# EasyEDA Pro project 2024-4T-MNT-1.eprj

# Schematic SCH
Create Date: 2024-03-03; Page Name: S1; Project Name: 2024-4T-MNT-1; Schematic Name: SCH; Update Date: 2024-03-03
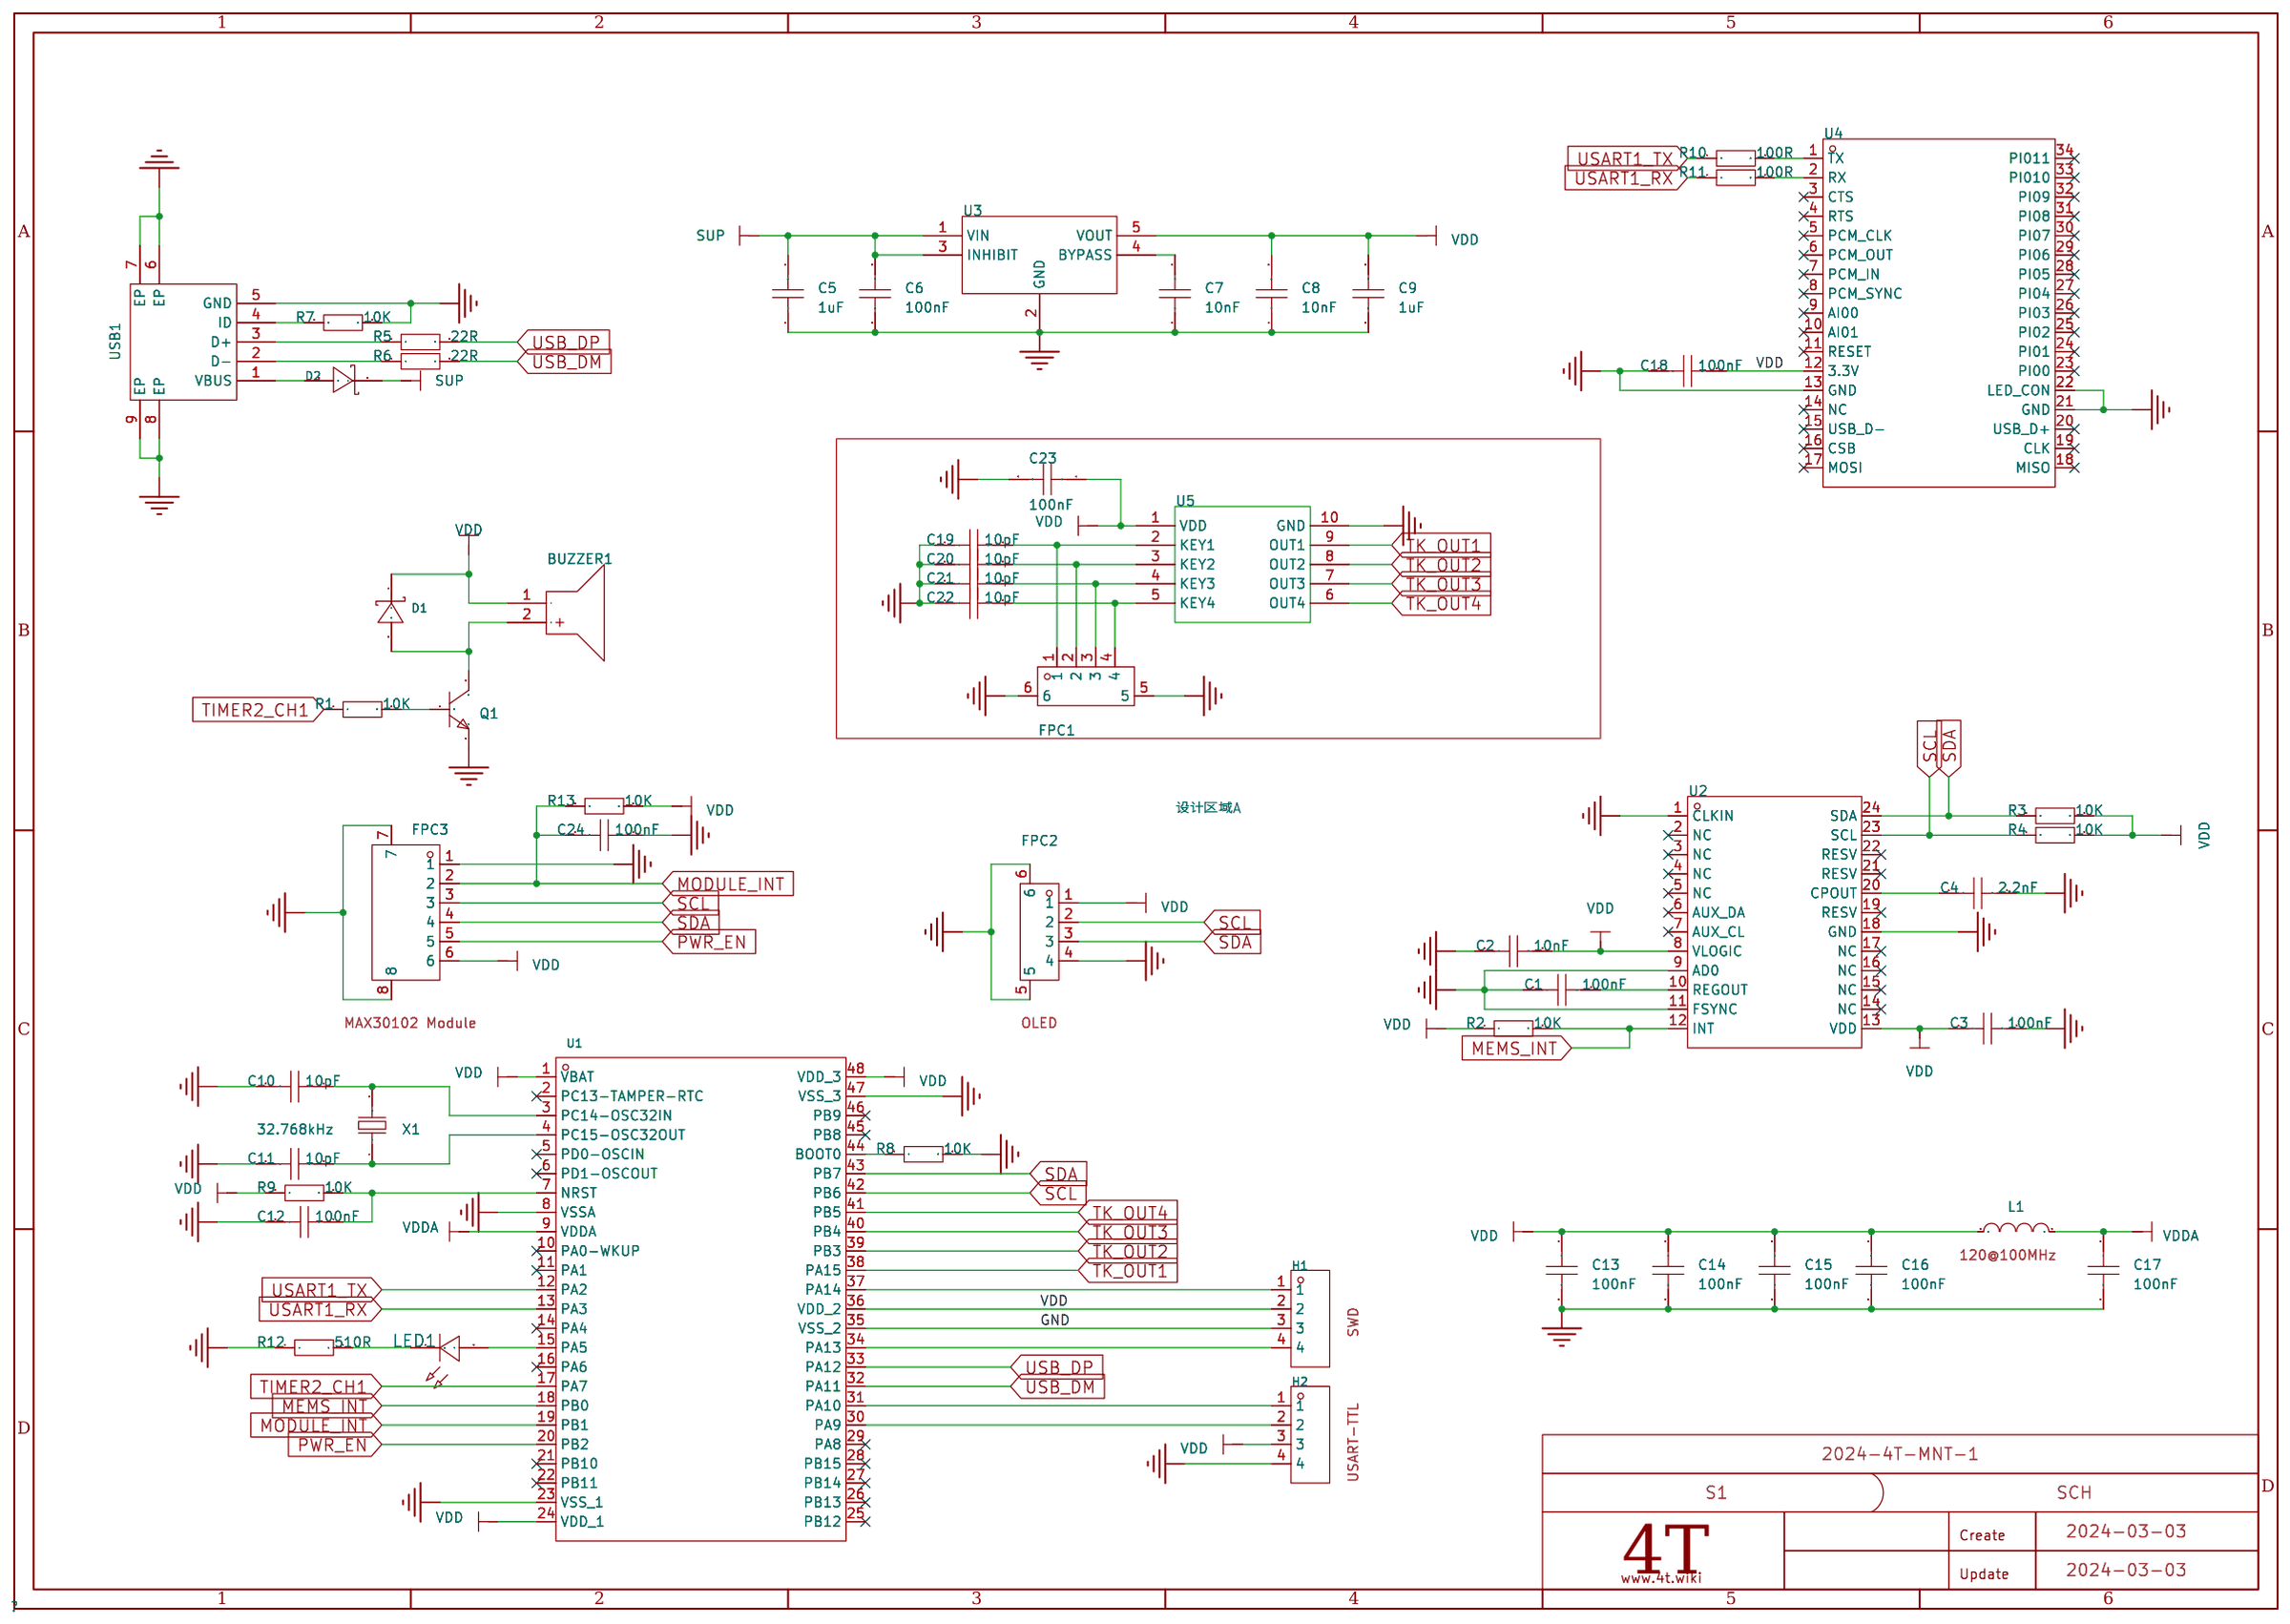
[diagram p0: schematic sheet]

## Parts
BUZZER1  buzzer  [BUZ-TH_BD12.0-P6.00-D0.9-RD]
C1  100nF  [C0805]
C2  10nF  [C0805]
C3  100nF  [C0805]
C4  2.2nF  [C0805]
C5  1uF  [C0805]
C6  100nF  [C0805]
C7  10nF  [C0805]
C8  10nF  [C0805]
C9  1uF  [C0805]
C10  10pF  [C0805]
C11  10pF  [C0805]
C12  100nF  [C0805]
C13  100nF  [C0805]
C14  100nF  [C0805]
C15  100nF  [C0805]
C16  100nF  [C0805]
C17  100nF  [C0805]
C18  100nF  [C0805]
C19  10pF  [C0805]
C20  10pF  [C0805]
C21  10pF  [C0805]
C22  10pF  [C0805]
C23  100nF  [C0805]
C24  100nF  [C0805]
D1  SS14  [SMA_L4.2-W2.6-LS5.3-RD]
D2  SS14  [SMA_L4.2-W2.6-LS5.3-RD]
FPC1  FPC-4PIN-1.0MM-上接  [FPC-SMD_4P-P1.00_AFA07-S04ECC-00]
FPC2  FPC-4PIN-1.0MM-上接  [FPC-SMD_4P-P1.00_AFA07-S04ECC-00]
FPC3  FPC6-0.5mm  [FPC-SMD_6P-L9.3-W4.1-P0.50]
H1  -  [HDR-TH_4P-P2.54-V-F]
H2  -  [HDR-TH_4P-P2.54-V-F]
L1  ACMS201209A6012A  [L0805]
LED1  -  [LED_0805]
Q1  S8050  [SOT-23-3_L2.9-W1.3-P1.90-LS2.4-BR]
R1  10K  [R0805]
R2  10K  [R0805]
R3  10K  [R0805]
R4  10K  [R0805]
R5  22R  [R0805]
R6  22R  [R0805]
R7  10K  [R0805]
R8  10K  [R0805]
R9  10K  [R0805]
R10  100R  [R0805]
R11  100R  [R0805]
R12  510R  [R0805]
R13  10K  [R0805]
U1  GD32F303CBT6  [LQFP-48_L7.0-W7.0-P0.50-LS9.0-BL]
U2  MPU6050  [QFN-24_L4.0-W4.0-P0.50-BL]
U3  LD3985M33R  [SOT-23-5_L3.0-W1.7-P0.95-LS2.8-BR]
U4  HC-05  [BULETM-SMD_HC-05]
U5  -  [SOT-CT4]
USB1  MicroUSB-5PIN  [USB-SMD_5P_MICROUSB-5PIN]
X1  32.768kHz  [FC-135R_L3.2-W1.5]

## Library data of the parts
BUZZER1 = buzzer: Supplier Part: C9900014030; JLCPCB Part Class: 扩展库; Supplier: LCSC
C1-C24 = CAP_0805: Supplier Footprint: 0805
D1 D2 = SS14_C2480: 二极管配置:独立式;直流反向耐压(Vr):40V;平均整流电流(Io):1A;正向压降(Vf):550mV@1A;; LCSC Part Name: 电压:40V 电流:1A 框架工艺; Supplier Part: C2480; Manufacturer: MDD; Supplier Footprint: SMA(DO-214AC); JLCPCB Part Class: 基础库; Datasheet: https://atta.szlcsc.com/upload/public/pdf/source/20230712/2DB6064CFBB99DE6DB116BEE8208BE66.pdf; Supplier: LCSC; Diode Configuration: 独立式; Reverse Voltage (Vr): 40V; Average Rectified Current (Io): 1A; Forward Voltage (Vf@If): 550mV@1A; Reverse Leakage Current (Ir): 500uA@40V
FPC1 = FPC-4PIN-1.0MM-上接: Supplier Part: C9900018775; Supplier Footprint: 4Pin_FPC_1mm; JLCPCB Part Class: 扩展库; Datasheet: https://atta.szlcsc.comnull; Supplier: LCSC
FPC2 = FPC-4PIN-1.0MM-上接: OLED; Supplier Part: C9900018775; Supplier Footprint: 4Pin_FPC_1mm; JLCPCB Part Class: 扩展库; Datasheet: https://atta.szlcsc.comnull; Supplier: LCSC
FPC3 = FPC6-0.5mm: MAX30102 Module; Supplier Part: C9900007660; Supplier Footprint: FPC-6P,0.5mm,上接; JLCPCB Part Class: 扩展库; Datasheet: https://atta.szlcsc.comnull; Supplier: LCSC
H1 = HDR-F_2.54_1x4P: SWD; Supplier Part: C2718488; Supplier Footprint: 插件
H2 = HDR-F_2.54_1x4P: USART-TTL; Supplier Part: C2718488; Supplier Footprint: 插件
L1 = ACMS201209A6012A: 120@100MHz; LCSC Part Name: 单路 0805磁珠 阻抗600Ω@100MHz; Supplier Part: C963878; Manufacturer: HYHONGYEX(宏业); Supplier Footprint: 0805; JLCPCB Part Class: 扩展库; Datasheet: https://atta.szlcsc.com/upload/public/pdf/source/20201201/C963878_9A58496702C302FABFA03D4B99520494.pdf; Supplier: LCSC; Impedance @ Frequency: 600Ω@100MHz; Tolerance: ±25%; DC Resistance: 100mΩ; Current Rating: 2A; Circuits: 1
LED1 = LED_0805-R: Supplier Footprint: 0805
Q1 = S8050: NPN 25V 500mA 120-400 SOT-23; LCSC Part Name: NPN 25V 500mA 120-400 SOT-23; Supplier Part: C2931719; Manufacturer: Doeshare(德芯); Supplier Footprint: SOT-23; JLCPCB Part Class: 扩展库; Datasheet: https://atta.szlcsc.com/upload/public/pdf/source/20220117/E6D3315E0D6ADDB25840BFFAC039C5C0.pdf; Supplier: LCSC
R1-R13 = Res_0805: Supplier Footprint: 0805
U1 = GD32F303CBT6: LCSC Part Name: 被合并商品; Supplier Part: C3013781; Supplier Footprint: LQFP-48(7x7); JLCPCB Part Class: 扩展库; Supplier: LCSC
U2 = MPU6050: Supplier Part: C9900042518; Supplier Footprint: QFN-24_L4.0-W4.0-P0.50-BL-EP2.7; Supplier: LCSC
U3 = LD3985M33R: 输出类型:固定;输出极性:正;最大输入电压:6V;输出电压:3.3V;输出电流:150mA;电源纹波抑制比(PSRR):60dB;; LCSC Part Name: 输入6V 输出3.3V 150mA; Supplier Part: C46243; Manufacturer: ST(意法半导体); Supplier Footprint: SOT-23-5; JLCPCB Part Class: 扩展库; Datasheet: https://atta.szlcsc.com/upload/public/pdf/source/20150407/1457707276603.pdf; Supplier: LCSC; Output Type: 固定; Output Polarity: 正; Number of Outputs: 1; Maximum Input Voltage: 6V; Output Voltage: 3.3V; Dropout Voltage: 100mV@(150mA); Quiescent Current (Ground Current): 150uA; Output Current: 150mA; Power Supply Rejection Ratio (PSRR): 60dB; Operating Temperature: -40℃~+125℃
U4 = HC-05: Supplier Part: C9900001063; Supplier Footprint: SMD-34_13.0X27.0X1.50P; JLCPCB Part Class: 扩展库; Datasheet: 2021-10-26/262798S/0744a6e575994a8186035cee355055ea/HC-05.pdf; Supplier: LCSC
U5 = CT4
USB1 = MicroUSB-5PIN: Supplier Part: C9900001196; Supplier Footprint: MicroUSB-5PIN,; JLCPCB Part Class: 扩展库; Supplier: LCSC
X1 = Q13FC1350000400: 频率:32.768kHz;频率公差:±20ppm;负载电容:12.5pF;; LCSC Part Name: 32.768kHz ±20ppm 12.5pF; Supplier Part: C32346; Manufacturer: EPSON(爱普生); Supplier Footprint: SMD3215-2P; JLCPCB Part Class: 基础库; Datasheet: https://atta.szlcsc.com/upload/public/pdf/source/20190108/C32346_746D6B07EAF90824457A96480007685F.pdf; Supplier: LCSC; Crystal Type: 贴片无源晶振; Frequency Tolerance: ±20ppm; Load Capacitance: 12.5pF; Equivalent Series Resistance (ESR): 70kΩ; Operating Temperature: -40℃~+85℃

## Nets
GND: C1.1 C2.1 C3.2 C4.2 C5.1 C6.1 C7.1 C8.1 C9.1 C10.2 C11.2 C12.2 C13.2 C14.2 C15.2 C16.2 C17.2 C18.1 C19.1 C20.1 C21.1 C22.1 C23.2 C24.1 FPC1.5 FPC1.6 FPC2.4 FPC2.5 FPC2.6 FPC3.1 FPC3.7 FPC3.8 H1.3 H2.4 Q1.2(E) R7.2 R8.2 R12.1 U1.8(VSSA) U1.23(VSS_1) U1.35(VSS_2) U1.47(VSS_3) U2.1(CLKIN) U2.9(AD0) U2.11(FSYNC) U2.18(GND) U3.2(GND) U4.13(GND) U4.21(GND) U4.22(LED_CON) U5.10(GND) USB1.5(GND) USB1.6(EP) USB1.7(EP) USB1.8(EP) USB1.9(EP)
VDD: BUZZER1.1(-) C2.2 C3.1 C8.2 C9.2 C13.1 C14.1 C15.1 C16.1 C18.2 C23.1 D1.1(K) FPC2.1 FPC3.6 H1.2 H2.3 L1.1 R2.1 R3.2 R4.2 R9.1 R13.2 U1.1(VBAT) U1.24(VDD_1) U1.36(VDD_2) U1.48(VDD_3) U2.8(VLOGIC) U2.13(VDD) U3.5(VOUT) U4.12(3.3V) U5.1(VDD)
VDDA: C17.1 L1.2 U1.9(VDDA)
MEMS_INT: R2.2 U1.18(PB0) U2.12(INT)
MODULE_INT: C24.2 FPC3.2 R13.1 U1.19(PB1)
PWR_EN: FPC3.5 U1.20(PB2)
SCL: FPC2.2 FPC3.3 R4.1 U1.42(PB6) U2.23(SCL)
SDA: FPC2.3 FPC3.4 R3.1 U1.43(PB7) U2.24(SDA)
SUP: C5.2 C6.2 D2.1(K) U3.1(VIN) U3.3(INHIBIT)
TIMER2_CH1: R1.1 U1.17(PA7)
TK_OUT1: U1.38(PA15) U5.9(OUT1)
TK_OUT2: U1.39(PB3) U5.8(OUT2)
TK_OUT3: U1.40(PB4) U5.7(OUT3)
TK_OUT4: U1.41(PB5) U5.6(OUT4)
USART1_RX: R11.1 U1.13(PA3)
USART1_TX: R10.1 U1.12(PA2)
USB_DM: R6.2 U1.32(PA11)
USB_DP: R5.2 U1.33(PA12)
$1N797: BUZZER1.2(+) D1.2(A) Q1.3(C)
$1N941: Q1.1(B) R1.2
$1N1221: C1.2 U2.10(REGOUT)
$1N1494: C4.1 U2.20(CPOUT)
$1N2047: R5.1 USB1.3(D+)
$1N2049: R6.1 USB1.2(D-)
$1N2097: R7.1 USB1.4(ID)
$1N2146: D2.2(A) USB1.1(VBUS)
$1N2344: C7.2 U3.4(BYPASS)
$1N2714: C10.1 U1.3(PC14-OSC32IN) X1.2
$1N2721: C11.1 U1.4(PC15-OSC32OUT) X1.1
$1N2943: R8.1 U1.44(BOOT0)
$1N3028: C12.1 R9.2 U1.7(NRST)
$1N3436: H1.1 U1.37(PA14)
$1N3445: H1.4 U1.34(PA13)
$1N3538: H2.1 U1.31(PA10)
$1N3541: H2.2 U1.30(PA9)
$1N4058: R10.2 U4.1(TX)
$1N4090: R11.2 U4.2(RX)
$1N5224: LED1.1(C) R12.2
$1N5231: LED1.2(A) U1.15(PA5)
$1N8240: C19.2 FPC1.1 U5.2(KEY1)
$1N8253: C20.2 FPC1.2 U5.3(KEY2)
$1N8266: C21.2 FPC1.3 U5.4(KEY3)
$1N8289: C22.2 FPC1.4 U5.5(KEY4)

Not connected (* = marked no-connect by the designer): U1 2(PC13-TAMPER-RTC)* 5(PD0-OSCIN)* 6(PD1-OSCOUT)* 10(PA0-WKUP)* 11(PA1)* 14(PA4)* 16(PA6)* 21(PB10)* 22(PB11)* 25(PB12)* 26(PB13)* 27(PB14)* 28(PB15)* 29(PA8)* 45(PB8)* 46(PB9)*; U2 2(NC)* 3(NC)* 4(NC)* 5(NC)* 6(AUX_DA)* 7(AUX_CL)* 14(NC)* 15(NC)* 16(NC)* 17(NC)* 19(RESV)* 21(RESV)* 22(RESV)*; U4 3(CTS)* 4(RTS)* 5(PCM_CLK)* 6(PCM_OUT)* 7(PCM_IN)* 8(PCM_SYNC)* 9(AI00)* 10(AI01)* 11(RESET)* 14(NC)* 15(USB_D-)* 16(CSB)* 17(MOSI)* 18(MISO)* 19(CLK)* 20(USB_D+)* 23(PI00)* 24(PI01)* 25(PI02)* 26(PI03)* 27(PI04)* 28(PI05)* 29(PI06)* 30(PI07)* 31(PI08)* 32(PI09)* 33(PI010)* 34(PI011)*

## Notes on the sheet
- 设计区域A

# Board PCB
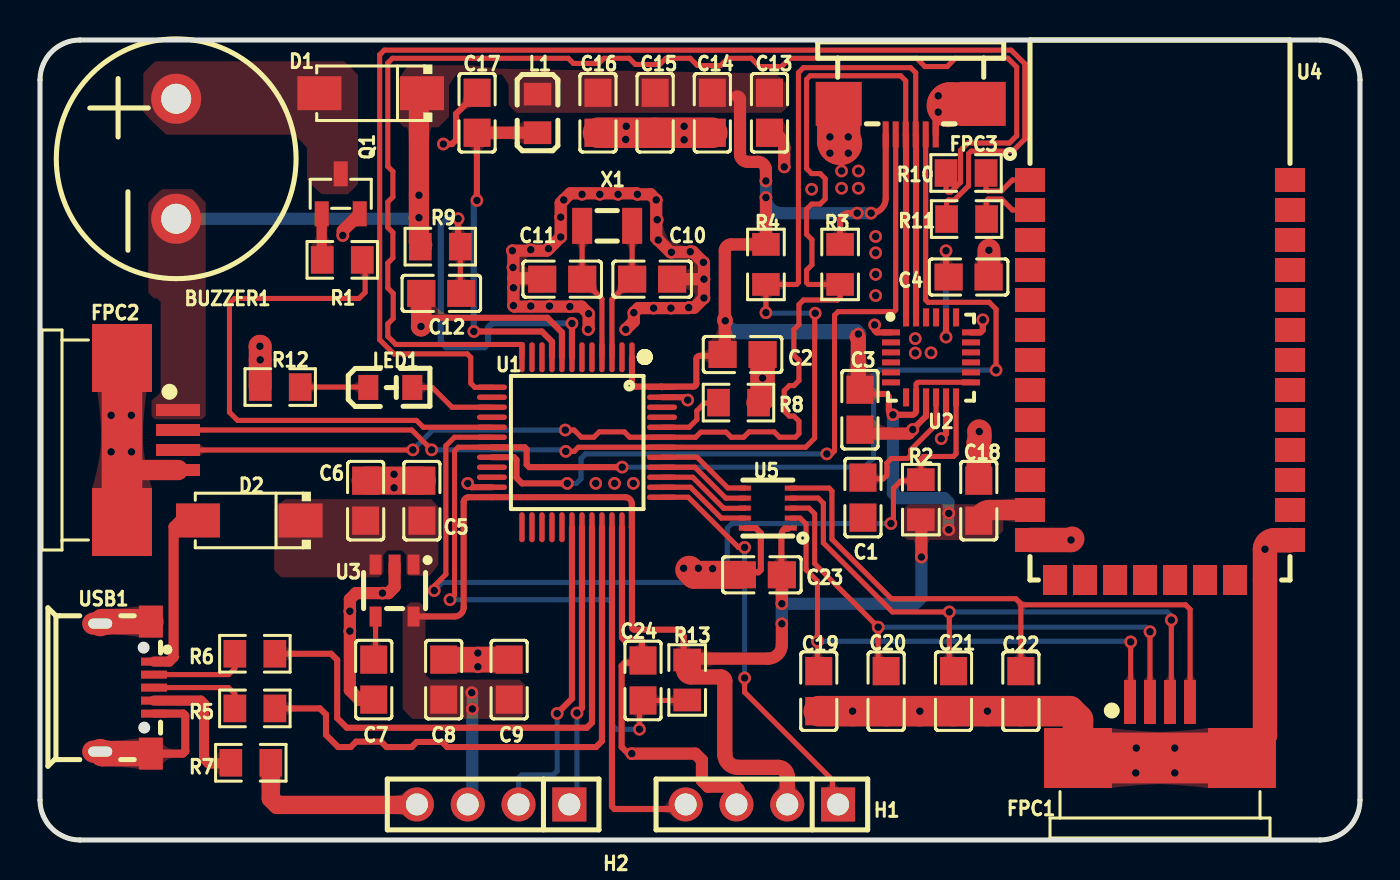
[diagram p1: board, top side]
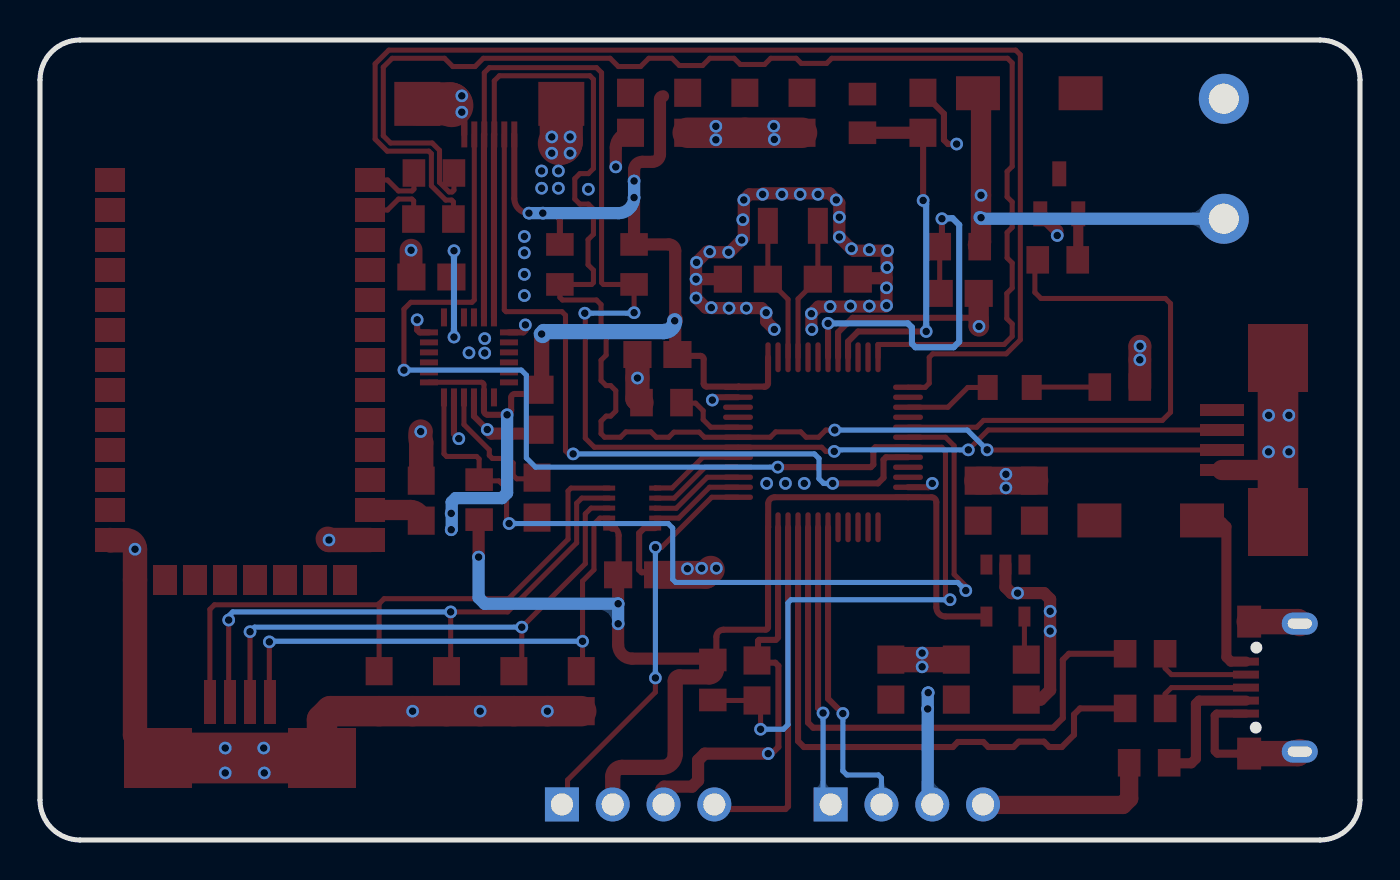
[diagram p2: board, bottom side, seen from below]

Outline 66 x 40 mm; copper layers: Top Layer, Bottom Layer. Coordinates in mm from the lower left corner of the outline.
Outline path: 0,38 0,2 arc(0.59,0.59) 2,0 64,0 arc(65.41,0.59) 66,2 66,38 arc(65.41,39.41) 64,40 2,40 arc(0.59,39.41) 0,38
Stack: Top Layer 0.035mm / Dielectric1 1.51mm FR4 er 4.5 / Bottom Layer 0.035mm

## Design rules (mm)
net $1N2714: DP4
net $1N2721: DP4
net USART1_TX: DP6
net USART1_RX: DP6
net USB_DM: DP3
net USB_DP: DP3
net SCL: DP1
net SDA: DP1
net $1N2047: DP2
net $1N2049: DP2
net $1N4058: DP5
net $1N4090: DP5
template: 自定义配置
spacing copperThickness1oz (default): track to track 0.178, other pairs 0.152 to 0.381
spacing copperThickness2oz: track to track 0.203, other pairs 0.152 to 0.3
track width copperThickness1oz (default): min 0.203, default 0.305, max 2.54
track width copperThickness2oz: min 0.203, default 0.254, max 2.54
track width trackWidth1: min 0.127, default 0.254, max 2.54
track width PWR: min 0.254, default 0.61, max 2.54
differential pair differentialPair (default): width min 0.127, default 0.254, max 2.54; gap min 0.152, default 0.152
via viaSize (default): diameter min 0.635, default 0.635, max 10; hole min 0.381, default 0.381, max 6.299
net VDD uses PWR
net GND uses PWR
net VDDA uses PWR
net SUP uses PWR

## Placement (name value [footprint] x y rotation side)
BUZZER1  buzzer  [BUZ-TH_BD12.0-P6.00-D0.9-RD]  6.81 34.06 90 top
C1  100nF  [C0805]  41.15 17.12 90 top
C2  10nF  [C0805]  35.13 24.27 180 top
C3  100nF  [C0805]  41 21.51 270 top
C4  2.2nF  [C0805]  46.43 28.15 0 top
C5  1uF  [C0805]  19.09 16.97 270 top
C6  100nF  [C0805]  16.28 16.97 270 top
C7  10nF  [C0805]  16.69 8.02 90 top
C8  10nF  [C0805]  20.19 8.02 270 top
C9  1uF  [C0805]  23.46 8.02 270 top
C10  10pF  [C0805]  30.61 28.04 0 top
C11  10pF  [C0805]  26.11 28.04 180 top
C12  100nF  [C0805]  20.07 27.33 180 top
C13  100nF  [C0805]  36.47 36.36 270 top
C14  100nF  [C0805]  33.62 36.36 270 top
C15  100nF  [C0805]  30.76 36.36 270 top
C16  100nF  [C0805]  27.9 36.36 270 top
C17  100nF  [C0805]  21.85 36.36 90 top
C18  100nF  [C0805]  46.94 16.97 270 top
C19  10pF  [C0805]  38.94 7.44 90 top
C20  10pF  [C0805]  42.31 7.44 90 top
C21  10pF  [C0805]  45.68 7.44 90 top
C22  10pF  [C0805]  49.04 7.44 90 top
C23  100nF  [C0805]  36.09 13.26 180 top
C24  100nF  [C0805]  30.15 7.98 270 top
D1  SS14  [SMA_L4.2-W2.6-LS5.3-RD]  16.54 37.34 180 top
D2  SS14  [SMA_L4.2-W2.6-LS5.3-RD]  10.47 15.98 180 top
FPC1  FPC-4PIN-1.0MM-上接  [FPC-SMD_4P-P1.00_AFA07-S04ECC-00]  56 5.5 0 top
FPC2  FPC-4PIN-1.0MM-上接  [FPC-SMD_4P-P1.00_AFA07-S04ECC-00]  5.5 20 270 top
FPC3  FPC6-0.5mm  [FPC-SMD_6P-L9.3-W4.1-P0.50]  43.54 36.04 180 top
H1  -  [HDR-TH_4P-P2.54-V-F]  36.09 1.78 180 top
H2  -  [HDR-TH_4P-P2.54-V-F]  22.66 1.78 180 top
L1  ACMS201209A6012A  [L0805]  24.88 36.33 270 top
LED1  -  [LED_0805]  17.56 22.62 0 top
Q1  S8050  [SOT-23-3_L2.9-W1.3-P1.90-LS2.4-BR]  15.04 32.31 270 top
R1  10K  [R0805]  15.11 29.01 180 top
R2  10K  [R0805]  44.04 17.02 90 top
R3  10K  [R0805]  40 28.78 90 top
R4  10K  [R0805]  36.3 28.78 90 top
R5  22R  [R0805]  10.74 6.58 0 top
R6  22R  [R0805]  10.74 9.31 0 top
R7  10K  [R0805]  10.54 3.86 0 top
R8  10K  [R0805]  34.93 21.87 0 top
R9  10K  [R0805]  20.01 29.67 0 top
R10  100R  [R0805]  46.3 33.35 0 top
R11  100R  [R0805]  46.33 31.05 0 top
R12  510R  [R0805]  12.01 22.65 0 top
R13  10K  [R0805]  32.36 8 90 top
U1  GD32F303CBT6  [LQFP-48_L7.0-W7.0-P0.50-LS9.0-BL]  26.85 19.89 180 top
U2  MPU6050  [QFN-24_L4.0-W4.0-P0.50-BL]  44.55 24.13 270 top
U3  LD3985M33R  [SOT-23-5_L3.0-W1.7-P0.95-LS2.8-BR]  17.73 12.47 90 top
U4  HC-05  [BULETM-SMD_HC-05]  56 23 0 top
U5  -  [SOT-CT4]  37.54 15.6 90 top
USB1  MicroUSB-5PIN  [USB-SMD_5P_MICROUSB-5PIN]  4.36 7.62 270 top
X1  32.768kHz  [FC-135R_L3.2-W1.5]  28.36 30.71 0 top

## Footprints (pads in the part's own frame, mm; a bottom-side part is the same pattern mirrored in y, then rotated)
BULETM-SMD_HC-05
  rect 1.5x1.2 smd: 1(-6.5,10) 2(-6.5,8.5) 3(-6.5,7) 4(-6.5,5.5) 5(-6.5,4) 6(-6.5,2.5) 7(-6.5,1) 8(-6.5,-0.5) 9(-6.5,-2) 10(-6.5,-3.5) 11(-6.5,-5) 12(-6.5,-6.5) 13(-6.5,-8) 22(6.5,-8) 23(6.5,-6.5) 24(6.5,-5) 25(6.5,-3.5) 26(6.5,-2) 27(6.5,-0.5) 28(6.5,1) 29(6.5,2.5) 30(6.5,4) 31(6.5,5.5) 32(6.5,7) 33(6.5,8.5) 34(6.5,10)
  rect 1.2x1.5 smd: 14(-5.25,-10) 15(-3.75,-10) 16(-2.25,-10) 17(-0.75,-10) 18(0.75,-10) 19(2.25,-10) 20(3.75,-10) 21(5.25,-10)
BUZ-TH_BD12.0-P6.00-D0.9-RD
  round 2.5 hole 1.5: 1(-3,0) 2(3,0)
C0805
  rect 1.41x1.35 smd: 1(-1,0) 2(1,0)
FC-135R_L3.2-W1.5
  rect 1x1.8 smd: 1(-1.25,0) 2(1.25,0)
FPC-SMD_4P-P1.00_AFA07-S04ECC-00
  rect 0.6x2.2 smd: 1(-1.5,1.4) 2(-0.5,1.4) 3(0.5,1.4) 4(1.5,1.4)
  rect 3.4x3 smd: 5(4.1,-1.4) 6(-4.1,-1.4)
FPC-SMD_6P-L9.3-W4.1-P0.50
  rect 0.3x1.3 smd: 1(-1.25,0.764) 2(-0.75,0.764) 3(-0.25,0.764) 4(0.25,0.764) 5(0.75,0.764) 6(1.25,0.764)
  rect 2.3x2.2 smd: 7(-3.6,-0.764) 8(3.6,-0.764)
HDR-TH_4P-P2.54-V-F
  rect 1.7x1.7 hole 1.1: 1(-3.81,0)
  round 1.7 hole 1.1: 2(-1.27,0) 3(1.27,0) 4(3.81,0)
L0805
  rect 1.133x1.377 smd: 1(-0.966,0) 2(0.966,0)
LED_0805
  rect 1x1.25 smd: 1(-1.15,0.005) 2(1.05,0.005)
LQFP-48_L7.0-W7.0-P0.50-LS9.0-BL
  oval 0.27x1.5 smd: 1(-2.75,-4.25) 2(-2.25,-4.25) 3(-1.75,-4.25) 4(-1.25,-4.25) 5(-0.75,-4.25) 6(-0.25,-4.25) 7(0.25,-4.25) 8(0.75,-4.25) 9(1.25,-4.25) 10(1.75,-4.25) 11(2.25,-4.25) 12(2.75,-4.25) 25(2.75,4.25) 26(2.25,4.25) 27(1.75,4.25) 28(1.25,4.25) 29(0.75,4.25) 30(0.25,4.25) 31(-0.25,4.25) 32(-0.75,4.25) 33(-1.25,4.25) 34(-1.75,4.25) 35(-2.25,4.25) 36(-2.75,4.25)
  oval 1.5x0.27 smd: 13(4.25,-2.75) 14(4.25,-2.25) 15(4.25,-1.75) 16(4.25,-1.25) 17(4.25,-0.75) 18(4.25,-0.25) 19(4.25,0.25) 20(4.25,0.75) 21(4.25,1.25) 22(4.25,1.75) 23(4.25,2.25) 24(4.25,2.75) 37(-4.25,2.75) 38(-4.25,2.25) 39(-4.25,1.75) 40(-4.25,1.25) 41(-4.25,0.75) 42(-4.25,0.25) 43(-4.25,-0.25) 44(-4.25,-0.75) 45(-4.25,-1.25) 46(-4.25,-1.75) 47(-4.25,-2.25) 48(-4.25,-2.75)
QFN-24_L4.0-W4.0-P0.50-BL
  rect 0.3x0.9 smd: 1(-1.25,-2) 2(-0.75,-2) 3(-0.25,-2) 4(0.25,-2) 5(0.75,-2) 6(1.25,-2) 13(1.25,2) 14(0.75,2) 15(0.25,2) 16(-0.25,2) 17(-0.75,2) 18(-1.25,2)
  rect 0.9x0.3 smd: 7(2,-1.25) 8(2,-0.75) 9(2,-0.25) 10(2,0.25) 11(2,0.75) 12(2,1.25) 19(-2,1.25) 20(-2,0.75) 21(-2,0.25) 22(-2,-0.25) 23(-2,-0.75) 24(-2,-1.25)
R0805
  rect 1.133x1.377 smd: 1(-1,0) 2(1,0)
SMA_L4.2-W2.6-LS5.3-RD
  rect 2.2x1.7 smd: 1(-2.566,0) 2(2.566,0)
SOT-23-3_L2.9-W1.3-P1.90-LS2.4-BR
  rect 1.25x0.7 smd: 1(1,-0.95) 2(1,0.95) 3(-1,0)
SOT-23-5_L3.0-W1.7-P0.95-LS2.8-BR
  rect 1x0.6 smd: 1(1.3,-0.95) 2(1.3,0) 3(1.3,0.95) 4(-1.3,0.95) 5(-1.3,-0.95)
SOT-CT4
  rect 0.25x0.6 smd: 1(0,0) 2(0.5,0) 3(1,0) 4(1.5,0) 5(2,0) 6(2,2.3) 7(1.5,2.3) 8(1,2.3) 9(0.5,2.3) 10(0,2.3)
USB-SMD_5P_MICROUSB-5PIN
  rect 0.4x1.3 smd: 1(-1.3,1.345) 2(-0.65,1.345) 3(0,1.345) 4(0.65,1.345) 5(1.3,1.345)
  rect 1.6x1.2 smd: 6(3.3,1.185) 7(-3.3,1.185)
  oval 1.1x1.8 hole 0.5x1.2: 8(3.2,-1.345) 9(-3.2,-1.345)

## Nets
As in the schematic.

Pads without a net: U1 2 5 6 10 11 14 16 21 22 25 26 27 28 29 45 46; U2 2 3 4 5 6 7 14 15 16 17 19 21 22; U4 3 4 5 6 7 8 9 10 11 14 15 16 17 18 19 20 23 24 25 26 27 28 29 30 31 32 33 34

## Via types
v1: diameter 0.635, hole 0.381, Top Layer to Bottom Layer, 141 vias

## Routing (per net, layer and track width the routed paths; a pad name or vN(x,y) marks a point on that pad's centre or on a via; arc(x,y) is an arc through that point)
GND: length 191
  Top Layer w0.305: 19.07,26.03 19.15,26.11 25.37,26.11 26.1,25.38 U1.8 ; U1.23 21.58,17.64 v1(21.39,17.83) ; U2.1 41.83,25.38 41.73,25.48 v1(41.73,25.76) ; C17.2 20.8,36.31 20.8,35 20.6,34.8 v1(20.17,34.8) ; FPC3.1 44.79,36.39 arc(44.78,36.41) 44.75,36.42 ; U1.47 32.24,22.14 v1(32.38,22) ; C23.2 35.22,13.39 35.92,13.39 36.04,13.51 36.04,15.34 35.79,15.6 U5.10 ; U2.9 44.3,21.19 v1(43.64,20.52) ; v1(45.06,20.07) 45.3,20.31 U2.11 ; v1(47.14,26.01) 47.14,25.5 47.02,25.38 U2.18 ; v1(29.59,4.32) 29.41,4.32 29.08,4.65 29.08,8.71 29.24,8.86 29.96,8.86 30.1,9 30.1,9.96 30.05,10.01 29.21,10.01 29.1,10.12 U1.35
  Top Layer w0.406: USB1.6 5.54,4.32 7.14,4.32 7.26,4.45 7.26,6.22 7.17,6.32 USB1.5
  Top Layer w0.61: v1(33.2,28.04) v1(33.2,27.1) 32.72,26.62 v1(32.44,26.62) 32.41,26.59 v1(31.55,26.59) v1(30.68,26.59) 29.92,26.59 v1(29.69,26.37) 29.69,25.93 v1(29.29,25.53) ; v1(33.2,28.04) 33.2,28.85 v1(33.17,28.88) 32.64,29.41 v1(32.51,29.41) 32.49,29.39 v1(31.57,29.39) 31.52,29.39 v1(30.91,30) 30.81,30.1 v1(30.81,32) 30.53,32.28 v1(29.87,32.28) 29.82,32.33 26.52,32.33 v1(26.19,32) 26.03,31.85 v1(26.03,31.14) v1(26.03,30.15) 25.45,29.57 v1(25.43,29.57) 25.32,29.46 v1(23.62,29.46) 23.67,29.41 23.67,28.09 ; v1(33.2,28.04) C10.2 ; C3.2 41.19,20.32 43.43,20.32 v1(43.64,20.52) ; v1(15.14,30.23) 15.14,30.46 Q1.2 ; 34.82,1.58 34.93,1.68 34.93,2.54 34.8,2.67 33.4,2.67 33.1,2.97 33.1,3.99 32.77,4.32 v1(29.59,4.32) ; U3.2 17.73,12.65 17.42,12.34 15.8,12.34 15.49,12.04 v1(15.49,11.44) v1(15.49,10.45) 15.49,7.49 15.97,7.02 C7.1 ; v1(37.21,33.66) 37.21,34.62 arc(37,35.15) C13.2 ; C11.2 25.06,28.09 23.67,28.09 ; 23.67,28.09 v1(23.67,27.61) v1(23.67,26.72) 23.72,26.67 v1(26.49,26.67) 27.08,26.67 v1(27.43,26.31) 27.43,25.55 v1(27.41,25.53)
  Top Layer w0.914: H2.4 18.82,1.75 11.86,1.75 11.54,2.07 R7.2
  Top Layer w1.016: 4.34,18.36 4.48,18.5 FPC2.4 ; v1(19.05,25.68) 19.07,25.7 C12.2
  Top Layer w1.143: R12.1 v1(11.01,24.01) 11.01,24.68 v1(11,24.69) ; v1(47.45,29.49) 47.45,28.17 C4.2
  Top Layer w1.219: R8.2 36.13,22.07 v1(36.13,23.1) C2.1 ; U4.13 v1(51.55,15) arc(51.59,15.02) 51.61,15.06 ; C18.1 46.94,19.86 arc(46.98,20.14) v1(46.96,20.42) ; FPC1.5 61.25,5.25 U4.21 v1(61.25,14.54) arc(61.38,14.86) 61.7,14.99 62.49,14.99 arc(62.5,14.99) U4.22
  Top Layer w1.27: USB1.9 3.11,10.92 USB1.7 ; USB1.6 3.11,4.32 USB1.8 ; C8.1 C9.1
  Top Layer w1.397: C6.1 C5.1 ; 32.46,13.51 32.72,13.26 C23.2
  Top Layer w1.524: FPC1.6 51.9,6.01 51.47,6.44 C22.1 v1(47.37,6.44) C21.1 v1(43.99,6.44) C20.1 v1(40.63,6.44) C19.1 ; C14.2 C15.2 C16.2
  Top Layer w2.032: FPC2.6 FPC2.5
  Top Layer w2.159: FPC3.7 45.49,36.81 arc(45.47,36.8) 45.45,36.79 arc(45.44,36.77) 45.44,36.75 45.41,36.72 ; FPC3.8 39.94,34.92 arc(39.94,34.88) 39.97,34.85 arc(40,34.83) 40.03,34.82
  Top Layer w2.54: FPC1.6 FPC1.5
  vias: v1(3.56,21.23) v1(3.56,19.41) v1(4.57,21.23) v1(4.57,19.41) v1(17.12,12.34) v1(17.7,18.29) v1(17.7,17.61) v1(21.9,9.35) v1(21.9,8.66) v1(23.65,28.63) v1(24.54,29.52) v1(24.54,26.7) v1(25.48,26.7) v1(27.1,32.28) v1(27.79,17.83) v1(27.99,32.28) v1(28.73,17.83) v1(28.91,32.28) v1(29.31,35.69) v1(29.29,35.03) v1(29.67,17.83) v1(30.86,31.01) v1(32.21,35.69) v1(32.21,35.01) v1(32.18,13.59) v1(32.92,13.59) v1(33.63,13.56) v1(38.58,32.54) v1(39.5,35.15) v1(39.5,34.34) v1(40.08,33.45) v1(40.08,32.59) v1(40.41,35.15) v1(40.41,34.34) v1(40.92,33.45) v1(40.92,32.59) v1(41.78,30.18) v1(41.78,29.36) v1(41.78,28.28) v1(41.78,27.22) v1(43.76,25.07) v1(43.76,24.35) v1(44.55,24.36) v1(44.91,37.21) v1(44.91,36.39) v1(54.81,4.6) v1(54.79,3.35) v1(56.74,4.6) v1(56.74,3.35)
VDD: length 151.8
  Top Layer w0.254: U2.8 43.8,22.77 arc(43.84,22.85) 43.92,22.89 46.55,22.89 arc(46.55,22.88) U2.13
  Top Layer w0.305: U2.8 43.8,21.45 arc(43.75,21.32) 43.61,21.26 v1(42.65,21.26) arc(42.49,21.34) 42.44,21.51 42.44,22.12 arc(42.39,22.25) 42.27,22.3 41.21,22.3 arc(41.06,22.36) C3.1 ; v1(40.86,31.34) 40.44,31.34 arc(40.13,31.22) 40,30.91 R3.2 ; 31.07,22.67 32.68,22.67 arc(32.78,22.71) 32.82,22.81 32.82,24.05 arc(32.86,24.16) 32.97,24.21 34.06,24.21 arc(34.11,24.23) C2.2 ; 31.07,22.67 31.08,22.66 arc(31.09,22.65) U1.48 ; 31.07,22.67 29.78,22.67 29.77,22.66 arc(29.65,22.71) 29.6,22.83 U1.1 ; 37.07,13.34 37.07,15.22 arc(37.11,15.41) 37.22,15.56 37.41,15.56 ; FPC3.6 42.29,32.08 arc(42.07,31.56) v1(41.55,31.34) ; 32.18,9 32.18,10.16 arc(32.08,10.41) 31.83,10.52 29.72,10.52 arc(29.63,10.55) 29.6,10.64 U1.36 arc(29.59,15.64) 29.59,15.65 29.59,16.82 arc(29.5,17.04) 29.27,17.14 U1.24 21.43,17.14 arc(21.26,17.07) 21.18,16.89 21.18,11.63 arc(21.05,11.31) 20.73,11.18 18.68,11.18 arc(18.68,11.17) U3.5
  Top Layer w0.61: v1(37.09,10.81) 37.09,9.76 arc(36.89,9.27) 36.4,9.07 32.25,9.07 arc(32.2,9.05) 32.18,9 ; 34.24,25.98 34.24,24.39 arc(34.21,24.31) C2.2 ; v1(44.07,14.15) 44.07,15.99 R2.1 ; C23.1 v1(37.09,11.81) ; v1(36.3,32.12) R4.2 34.55,29.78 arc(34.33,29.69) 34.24,29.46 34.24,26.04 ; v1(36.3,32.95) 36.3,33.5 arc(36.18,33.79) 35.89,33.91 35.38,33.91 arc(35.11,34.02) 35,34.29 35,37.03 arc(34.96,37.14) 34.85,37.19
  Top Layer w0.762: 32.18,9 32.18,8.51 arc(32.29,8.26) 32.54,8.15 34.04,8.15 arc(34.18,8.09) 34.24,7.95 34.24,4.29 arc(34.43,3.83) 34.9,3.63 36.91,3.63 arc(37.23,3.5) 37.36,3.18 37.36,1.58 ; 34.24,26.04 34.24,25.98 arc(34.25,25.97) v1(34.26,25.96) ; 40.87,25.17 40.87,25.15 40.92,25.1 40.92,22.33 40.87,22.29
  Top Layer w1.016: U4.12 47.47,16.5 arc(47.1,16.34) C18.2 ; D1.1 18.95,37.19 v1(18.95,32.24) v1(18.95,31.12) 18.95,29.91 19.1,29.75 arc(19.08,29.69) R9.1
  Bottom Layer w0.61: v1(42.65,21.26) 42.65,17.35 42.9,17.09 45.21,17.09 45.41,16.89 45.41,15.54 v1(45.44,15.51) ; v1(37.09,10.81) v1(37.09,11.81) 43.76,11.81 44.07,12.12 v1(44.07,14.15) ; v1(21.59,7.37) 21.62,7.34 v1(21.62,6.55) 21.62,2.01 H2.3 ; v1(41.55,31.34) v1(40.86,31.34) 37.07,31.34 arc(36.52,31.57) v1(36.3,32.12) v1(36.3,32.95) ; BUZZER1.1 18.95,31.06 arc(19,31.08) 19.02,31.14
  Bottom Layer w0.762: 40.81,25.43 40.81,25.42 34.8,25.42 34.8,25.43 arc(34.42,25.58) v1(34.26,25.96) ; 40.94,25.3 arc(40.91,25.24) 40.86,25.22
  vias: v1(40.92,25.3) v1(45.44,16.33)
VDDA: length 17.9
  Top Layer w0.305: C17.1 21.84,35.35 v1(21.84,31.98) ; U1.9 25.6,24.92 25.09,25.43 v1(21.69,25.43)
  Top Layer w0.61: C17.1 24.87,35.36
  Bottom Layer w0.305: v1(21.69,25.43) 21.69,31.83 v1(21.84,31.98)
MEMS_INT: length 44.8
  Top Layer w0.254: v1(42.54,15.82) 42.67,15.95 42.67,17.58 43.05,17.96 43.98,17.96 R2.2 44.04,19.05 44.17,19.18 45.67,19.18 45.8,19.31 U2.12 ; U1.18 20.72,20.14 20.29,19.71 20.29,13.28 19.71,12.7 v1(19.71,12.47)
  Bottom Layer w0.254: v1(19.71,12.47) 20.12,12.88 34.21,12.88 34.37,13.03 34.37,15.6 34.59,15.82 v1(42.54,15.82)
MODULE_INT: length 74.3
  Top Layer w0.254: U1.19 20.91,19.64 20.73,19.46 20.73,12.24 v1(20.5,12.01) ; FPC3.2 44.29,27 44.4,26.89 47.46,26.89 47.8,26.54 v1(47.8,23.5) ; v1(29.97,5.54) 29.97,6.87 30.07,6.98 32.16,6.98 arc(32.17,6.98) 32.18,7
  Top Layer w0.305: v1(29.11,18.64) 24.46,18.64 24.33,18.77 24.33,19.53 24.23,19.64 U1.19
  Bottom Layer w0.254: v1(47.8,23.5) 41.94,23.5 41.68,23.24 41.68,19.1 41.22,18.64 v1(29.11,18.64) ; v1(20.5,12.01) 28.45,12.01 28.6,11.86 28.6,5.77 28.83,5.54 v1(29.97,5.54)
PWR_EN: length 38.2
  Top Layer w0.254: FPC3.5 42.79,26.5 42.7,26.42 39.9,26.42 39.73,26.24 39.73,19.46 39.57,19.3 v1(39.34,19.3)
  Top Layer w0.305: v1(26.37,17.83) 24.1,17.83 23.82,18.11 23.82,19.01 23.7,19.14 U1.20
  Bottom Layer w0.254: v1(39.34,19.3) 27.28,19.3 27.05,19.08 27.05,18.06 26.82,17.83 v1(26.37,17.83)
SCL: length 73.2
  Top Layer w0.254: FPC2.2 18.59,20.5 v1(19.58,19.51) 19.61,19.51 ; FPC3.3 43.79,38.36 43.53,38.62 38.18,38.62 37.92,38.36 37.92,27.87 37.83,27.78 R4.1 v1(36.3,26.37) ; v1(26.29,19.43) 26.71,19.43 26.92,19.64 U1.42 38.28,19.64 38.74,20.09 38.74,26.31 v1(38.76,26.34)
  Top Layer w0.305: FPC3.3 43.8,35.26 U2.23
  Bottom Layer w0.254: v1(19.58,19.51) 26.21,19.51 v1(26.29,19.43) ; v1(36.3,26.37) 36.32,26.34 v1(38.76,26.34)
SDA: length 73.1
  Top Layer w0.254: FPC2.3 18.64,19.5 v1(18.64,19.51) ; v1(26.26,20.5) 26.71,20.5 27.07,20.14 27.69,20.14 27.96,20.41 29.22,20.41 29.49,20.14 U1.43 32.78,20.14 33.04,20.39 34.31,20.39 34.56,20.14 35.19,20.14 35.45,20.41 36.71,20.41 36.98,20.14 37.77,20.14 37.95,20.32 37.95,20.94 37.69,21.2 37.47,21.2 37.21,21.45 37.21,22.47 37.47,22.72 37.69,22.72 37.95,22.97 37.95,23.99 37.69,24.24 37.69,25.51 37.95,25.77 37.95,26.77 38.18,27 39.88,27 40,27.13 R3.1 38.42,27.78 38.33,27.87 38.33,28.49 38.6,28.76 38.6,30.02 38.33,30.29 38.33,31.54 38.58,31.8 39.01,31.8 39.26,32.05 39.26,33.07 39.01,33.32 38.58,33.32 38.33,33.57 38.33,38.03 38.51,38.21 43.03,38.21 43.29,37.96 FPC3.4
  Top Layer w0.305: FPC3.4 43.3,35.26 U2.24
  Bottom Layer w0.254: v1(18.64,19.51) 19.63,20.5 v1(26.26,20.5)
TIMER2_CH1: length 27.6
  Top Layer w0.254: U1.17 19.16,20.64 18.82,20.98 9.88,20.98 9.47,21.39 9.47,26.82 9.73,27.08 15.95,27.08 16.26,27.38 16.26,28.86 R1.1
TK_OUT1: length 4.8
  Top Layer w0.254: U1.38 32.52,17.64 34.07,16.1 U5.9
TK_OUT2: length 4.8
  Top Layer w0.254: U5.8 35.23,16.59 34.19,16.59 32.63,18.14 U1.39
TK_OUT3: length 4.8
  Top Layer w0.254: U1.40 32.75,18.64 34.29,17.09 35.24,17.09
TK_OUT4: length 4.8
  Top Layer w0.254: U5.6 35.23,17.6 34.39,17.6 32.86,19.14 U1.41
USART1_RX: length 65
  Top Layer w0.254: R11.1 45.33,31.91 45.42,32 45.71,32 46.43,32.71 46.43,34.32 46.56,34.44 48.64,34.44 49.24,35.04 49.24,38.81 48.56,39.49 17.22,39.49 16.98,39.26 16.98,25.01 17.69,24.31 21.36,24.31 21.54,24.13 21.54,22.83 21.74,22.63 22.59,22.63 U1.13
USART1_TX: length 65
  Top Layer w0.254: R10.1 45.3,32.49 45.39,32.4 45.55,32.4 46.03,32.88 46.03,34.48 46.39,34.85 48.47,34.85 48.84,35.21 48.84,38.64 48.39,39.09 45.77,39.09 45.36,38.67 44.25,38.67 43.83,39.09 37.5,39.09 37.08,38.67 35.97,38.67 35.56,39.09 34.39,39.09 34.03,38.72 32.87,38.72 32.51,39.09 31.29,39.09 30.99,38.78 29.77,38.78 29.46,39.09 28.19,39.09 27.94,38.83 26.67,38.83 26.41,39.09 17.62,39.09 17.39,38.85 17.39,33.68 17.64,33.43 17.64,32.16 17.39,31.9 17.39,30.63 17.64,30.38 17.64,29.11 17.39,28.85 17.39,27.6 17.66,27.33 17.66,26.07 17.39,25.81 17.39,25.18 17.79,24.78 24.1,24.78 U1.12
USB_DM: length 29
  Top Layer w0.305: U1.32 27.6,5.87 27.34,5.61 15.34,5.61 14.86,6.1 14.86,9.01 14.55,9.31 R6.2
USB_DP: length 29
  Top Layer w0.305: R5.2 14,6.58 14.3,6.27 14.3,5.26 14.91,4.65 15.53,4.65 15.8,4.92 17.06,4.92 17.33,4.65 18.58,4.65 18.84,4.9 20.11,4.9 20.36,4.65 27.8,4.65 28.1,4.94 U1.33
$1N941: length 2.3
  Top Layer w0.508: Q1.1 14.09,29.03 arc(14.09,29.01) R1.2
$1N1221: length 6.7
  Top Layer w0.254: C1.2 41.21,18.06 42.16,18.06 42.34,18.24 42.34,18.85 42.57,19.08 43.38,19.08 43.54,19.23 43.54,19.51 44.8,20.77 U2.10
$1N1494: length 6.7
  Top Layer w0.305: v1(45.3,29.46) 45.3,28.28 C4.1 ; U2.20 v1(45.3,25.15)
  Bottom Layer w0.305: v1(45.3,25.15) v1(45.3,29.46)
$1N2047: length 4.9
  Top Layer w0.254: USB1.3 9.43,7.62 9.74,7.3 R5.1
$1N2049: length 4.9
  Top Layer w0.254: USB1.2 9.43,8.27 9.74,8.59 R6.1
$1N2097: length 6.8
  Top Layer w0.508: USB1.4 8.04,6.97 8.2,6.81 8.2,4.06 8.43,3.84 9.52,3.84 R7.1
$1N2146: length 9
  Top Layer w0.508: 7.9,16.23 7.57,15.9 6.91,15.9 6.68,15.67 6.68,9.14 6.46,8.92 USB1.1
$1N2344: length 2.4
  Top Layer w0.254: U3.4 16.78,9.48 arc(16.64,9.16) 16.32,9.02
$1N2714: length 7
  Top Layer w0.254: X1.2 C10.1 28.6,27.03 U1.3
$1N2721: length 7
  Top Layer w0.254: X1.1 27.11,28.05 C11.1 28.1,27.06 U1.4
$1N2943: length 3.6
  Top Layer w0.254: R8.1 33.9,21.84 33.22,21.84 32.84,21.46 32.84,21.02 32.46,20.64 U1.44
$1N3028: length 20
  Top Layer w0.254: R9.2 21.01,27.38 C12.1
  Top Layer w0.305: U1.7 v1(26.6,25.83) ; v1(20.9,31.06) 20.9,29.78 R9.2
  Bottom Layer w0.305: v1(20.9,31.06) 20.88,31.09 20.37,31.09 20.04,30.76 20.04,24.92 20.32,24.64 22.22,24.64 22.4,24.82 22.4,25.63 22.61,25.83 v1(26.6,25.83)
$1N3436: length 20.2
  Top Layer w0.254: U1.37 32.41,17.14 34.92,14.63 v1(35.23,14.63) ; 39.9,1.58 39.62,1.85 39.62,3 35.23,7.39 v1(35.23,8.1)
  Bottom Layer w0.254: v1(35.23,14.63) v1(35.23,8.1)
$1N3445: length 17.7
  Top Layer w0.305: U1.34 28.6,1.68 28.73,1.55 32.26,1.55 32.28,1.58
$1N3538: length 14.1
  Top Layer w0.305: v1(26.85,6.35) 27.1,6.6 U1.31
  Bottom Layer w0.254: v1(26.85,6.35) 26.85,2.16 H2.1
$1N3541: length 15.9
  Top Layer w0.305: v1(25.86,6.32) 26.6,7.07 U1.30
  Bottom Layer w0.254: v1(25.86,6.32) 25.86,3.45 25.65,3.25 24.08,3.25 23.93,3.1 H2.2
$1N4058: length 3.3
  Top Layer w0.254: U4.1 48.62,33 48.08,32.45 47.39,32.45 47.3,32.54 R10.2
$1N4090: length 3.4
  Top Layer w0.254: R11.2 47.32,31.06 47.32,31.96 47.41,32.05 48.08,32.05 48.62,31.5 U4.2
$1N5224: length 3.4
  Top Layer w0.254: R12.2 16.39,22.65 arc(16.41,22.64) LED1.1
$1N5231: length 4.4
  Top Layer w0.254: U1.15 20.6,21.64 19.61,22.63 LED1.2
$1N8240: length 27.2
  Top Layer w0.254: U5.2 38.01,16.1 38.3,15.8 38.3,13.51 38.87,12.94 v1(38.87,9.94) 38.87,8.51 C19.2 ; FPC1.1 54.53,6.93 v1(54.53,9.91)
  Bottom Layer w0.254: v1(54.53,9.91) 54.5,9.94 v1(38.87,9.94)
$1N8253: length 27.9
  Top Layer w0.254: U5.3 38.45,16.6 38.74,16.31 38.74,13.82 v1(41.91,10.64) 41.91,8.84 C20.2 ; v1(55.5,10.41) FPC1.2
  Bottom Layer w0.254: v1(41.91,10.64) 55.27,10.64 v1(55.5,10.41)
$1N8266: length 30
  Top Layer w0.254: v1(56.57,11) 56.57,6.97 FPC1.3 ; U5.4 38.91,17.1 39.17,16.84 39.17,14.86 42.62,11.4 v1(45.47,11.4) 45.47,8.65 C21.2
  Bottom Layer w0.254: v1(45.47,11.4) 56.36,11.4 56.57,11.2 v1(56.57,11)
$1N8289: length 31.9
  Top Layer w0.254: 49.04,11.81 48.79,12.07 42.57,12.07 39.6,15.04 39.6,17.45 39.45,17.6 U5.5 ; 49.04,11.81 49.1,11.76 57.28,11.76 57.51,11.53 57.51,6.91 FPC1.4 ; 49.04,11.81 C22.2

## Copper pours and planes (outline as drawn; the poured copper is in the pictures)
GND on Top Layer: -7.19,43.03 69.95,43.03 69.95,-5.11 -7.19,-5.11
GND on Bottom Layer: -4.9,45.31 67.77,45.31 67.77,-8.31 -4.9,-8.31
VDD on Top Layer: 18.13,11.89 24.36,11.89 24.36,6.06 18.13,6.06
VDD on Top Layer: 5.42,32.54 8.29,32.54 8.29,21.03 5.42,21.03
VDD on Top Layer: 17.87,38.73 37.38,38.73 37.38,35.64 17.87,35.64
VDD on Top Layer: 43.13,16.79 48.16,16.79 48.16,15 43.13,15
SUP on Top Layer: 11.71,17.04 19.92,17.04 19.92,13.13 11.71,13.13
$1N797 on Top Layer: 5.16,38.94 15.9,38.94 15.9,32.29 5.16,32.29

Small or netless copper shapes (teardrops, artwork), in the pictures only: 170 on Top Layer, 35 on Bottom Layer
